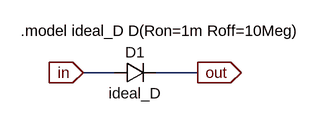
[diagram p0: schematic idealD.asc]
idealD.asc, the LTspice schematic file:
Version 4
SHEET 1 880 680
WIRE 176 160 128 160
WIRE 304 160 240 160
FLAG 128 160 in
IOPIN 128 160 In
FLAG 304 160 out
IOPIN 304 160 Out
SYMBOL diode 176 176 R270
WINDOW 0 32 32 VTop 2
WINDOW 3 0 32 VBottom 2
SYMATTR InstName D1
SYMATTR Value ideal_D
TEXT 32 96 Left 2 !.model ideal_D D(Ron=1m Roff=10Meg)

The netlist it stands for:
* idealD.asc
D1 in out ideal_D
.model D D
.lib standard.dio
.model ideal_D D(Ron=1m Roff=10Meg)
.backanno
.end